# EAGLE design qec_pcb_1 (EAGLE 9.2.1)
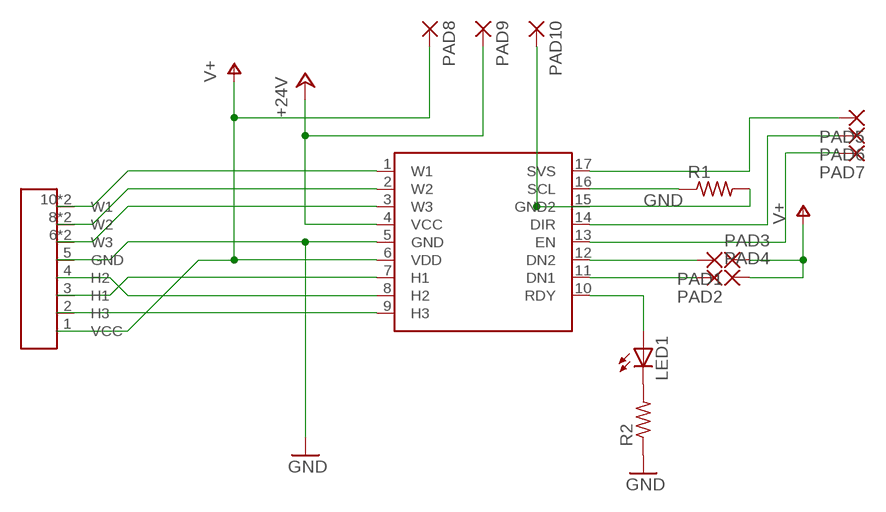
[diagram p0: schematic, sheet 1]

## Parts
K1  68611114122  [68611114122]
LED1  LEDCHIPLED_0805  [CHIPLED_0805]
PAD1  SMD2  [SMD1,27-2,54]
PAD2  SMD2  [SMD1,27-2,54]
PAD3  SMD2  [SMD1,27-2,54]
PAD4  SMD2  [SMD1,27-2,54]
PAD5  SMD2  [SMD1,27-2,54]
PAD6  SMD2  [SMD1,27-2,54]
PAD7  SMD2  [SMD1,27-2,54]
PAD8  SMD5  [SMD2,54-5,08]
PAD9  SMD5  [SMD2,54-5,08]
PAD10  SMD5  [SMD2,54-5,08]
R1  R-US_M0805  [M0805]
R2  R-US_M0805  [M0805]
U$1  1-Q-EC1-Q-EC-SMD  [1-Q-EC-SMD]

## Nets
+24V: PAD9.1(P) U$1.4(VCC)
GND: K1.5(GND) PAD10.1(P) R1.2 R2.1 U$1.5(GND) U$1.15(GND2)
N$1: LED1.C R2.2
N$2: LED1.A U$1.10(RDY)
N$3: PAD2.1(P) U$1.11(DN1)
N$4: PAD1.1(P) U$1.12(DN2)
N$5: K1.10(W1) K1.11(W1) U$1.1(W1)
N$6: R1.1 U$1.16(SCL)
N$8: PAD6.1(P) U$1.14(DIR)
N$9: PAD7.1(P) U$1.13(EN)
N$10: PAD5.1(P) U$1.17(SVS)
N$11: K1.8(W2) K1.9(W2) U$1.2(W2)
N$12: K1.6(W3) K1.7(W3) U$1.3(W3)
N$13: K1.3(H1) U$1.7(H1)
N$14: K1.4(H2) U$1.8(H2)
N$16: K1.2(H3) U$1.9(H3)
V+: K1.1(VCC) PAD3.1(P) PAD4.1(P) PAD8.1(P) U$1.6(VDD)

## Library data of the parts
K1 = dedo:68611114122: WR-FPC 1.00mm SMT ZIF Horizontal Top Contact, 11 Pins=>Code : Con_FPC_ZIF_1.00_68611114122 <http://katalog.we-online.de/media/images/eican/Con_FPC_ZIF_1.00_6861xx14122_pf2.jpg> Details see: http://katalog.we-online.de/en/em/686_1xx_141_22 Created 2014-07-09, Karrer Zheng 2014 (C) Würth Elektronik
LED1 = led:LED: LED OSRAM: - CHIPLED LG R971, LG N971, LY N971, LG Q971, LY Q971, LO R971, LY R971 LH N974, LH R974 LS Q976, LO Q976, LY Q976 LO Q996 - Hyper CHIPLED LW Q18S LB Q993, LB Q99A, LB R99A - SideLED LS A670, LO A670, LY A670, LG A670, LP A670 LB A673, LV A673, LT A673, LW A673 LH A674 LY A675 LS A676, LA A676, LO A676, LY A676, LW A676 LS A679, LY A679, LG A679 - Hyper Micro SIDELED® LS Y876, LA Y876, LO Y876, LY Y876 LT Y87S - SmartLED LW L88C, LW L88S LB L89C, LB L89S, LG L890 LS L89K, LO L89K, LY L89K LS L896, LA L896, LO L896, LY L896 - TOPLED LS T670, LO T670, LY T670, LG T670, LP T670 LSG T670, LSP T670, LSY T670, LOP T670, LYG T670 LG T671, LOG T671, LSG T671 LB T673, LV T673, LT T673, LW T673 LH T674 LS T676, LA T676, LO T676, LY T676, LB T676, LH T676, LSB T676, LW T676 LB T67C, LV T67C, LT T67C, LS T67K, LO T67K, LY T67K, LW E67C LS E67B, LA E67B, LO E67B, LY E67B, LB E67C, LV E67C, LT E67C LW T67C LS T679, LY T679, LG T679 LS T770, LO T770, LY T770, LG T770, LP T770 LB T773, LV T773, LT T773, LW T773 LH T774 LS E675, LA E675, LY E675, LS T675 LS T776, LA T776, LO T776, LY T776, LB T776 LHGB T686 LT T68C, LB T68C - Hyper Mini TOPLED® LB M676 - Mini TOPLED Santana® LG M470 LS M47K, LO M47K, LY M47K Source: http://www.osram.convergy.de LUXEON: - LUMILED® LXK2-PW12-R00, LXK2-PW12-S00, LXK2-PW14-U00, LXK2-PW14-V00 LXK2-PM12-R00, LXK2-PM12-S00, LXK2-PM14-U00 LXK2-PE12-Q00, LXK2-PE12-R00, LXK2-PE12-S00, LXK2-PE14-T00, LXK2-PE14-U00 LXK2-PB12-K00, LXK2-PB12-L00, LXK2-PB12-M00, LXK2-PB14-N00, LXK2-PB14-P00, LXK2-PB14-Q00 LXK2-PR12-L00, LXK2-PR12-M00, LXK2-PR14-Q00, LXK2-PR14-R00 LXK2-PD12-Q00, LXK2-PD12-R00, LXK2-PD12-S00 LXK2-PH12-R00, LXK2-PH12-S00 LXK2-PL12-P00, LXK2-PL12-Q00, LXK2-PL12-R00 Source: www.luxeon.com KINGBRIGHT: KA-3528ASYC Source: www.kingbright.com
PAD1-PAD7 = wirepad:SMD2: SMD PAD
PAD8-PAD10 = wirepad:SMD5: SMD PAD
R1 R2 = resistor:R-US_: RESISTOR, American symbol
U$1 = dedo:1-Q-EC

## Board
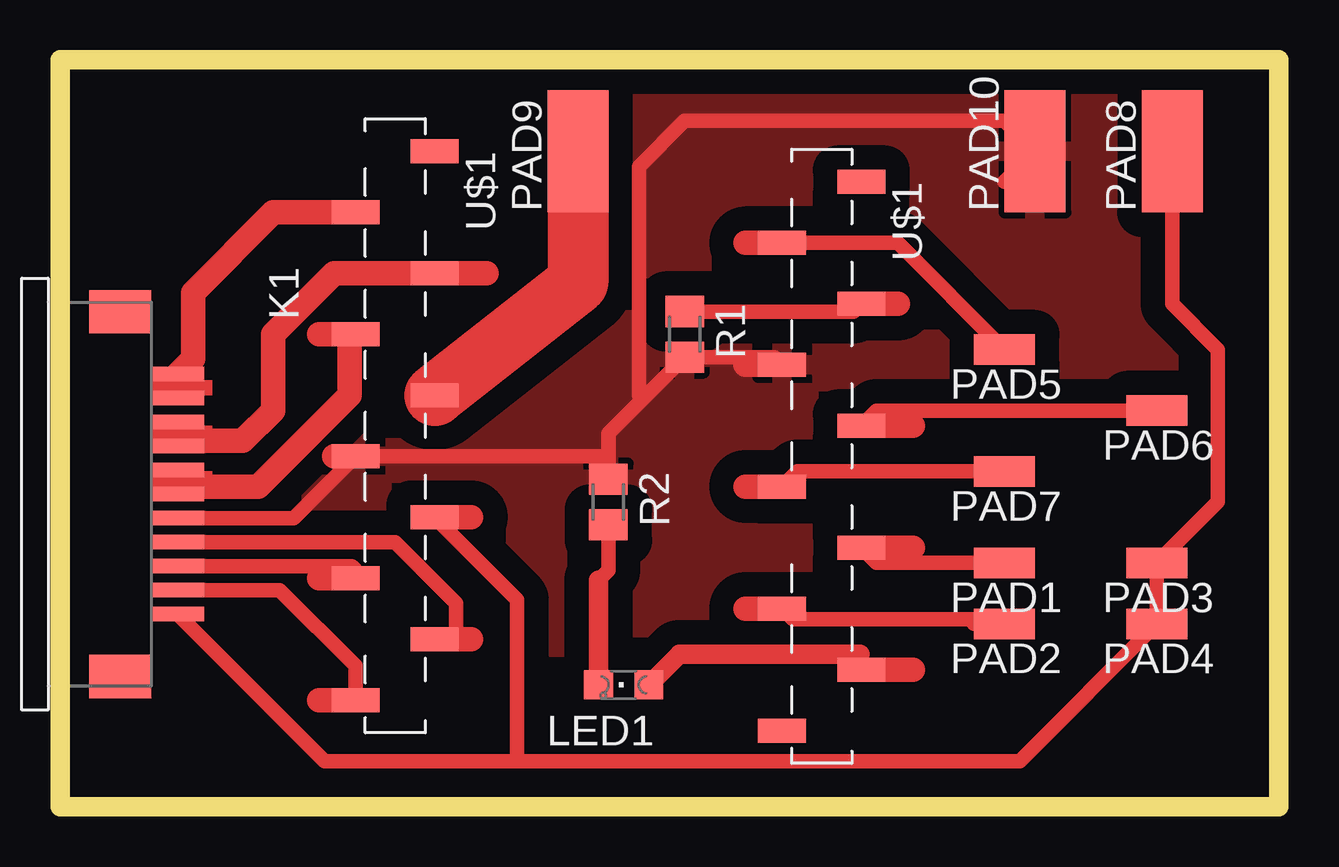
[diagram p1: board, top side]

Size 50.8 x 31.11 mm. Coordinates in mm from the lower left corner, seen from the top.
Outline: 0,31.11 50.8,31.11 50.8,0 0,0 0,31.11
Copper layers (1*16): Top 0.035mm / dielectric 1.5mm / Bottom 0.035mm
Design rules "default": minimum track width 6mil, minimum drill 0.35mm, track to track 6mil, track to pad 6mil, pad to pad 6mil, via to via 6mil, smd to smd 6mil, copper to edge 40mil, drill to drill 6mil, minimum pad ring 10mil, minimum via ring 8mil, stop-mask expansion 4mil, vias tented up to drill 0mil, thermal gap 10mil

### Footprints (pad centres in the part's own frame; a part is rotated, then mirrored left to right if it is on the bottom)
68611114122 = smd 0.6 x 2.2: 1 1.5,1.1; 2 0.5,1.1; 3 -0.5,1.1; 4 -1.5,1.1; 5 -2.5,1.1; 6 -3.5,1.1; 7 -4.5,1.1; 8 -5.5,1.1; 9 -6.5,1.1; 10 -7.5,1.1; 11 -8.5,1.1 | smd 1.8 x 2.6: Z1 -11.1,-1.3; Z2 4.1,-1.3
CHIPLED_0805 = smd 1.2 x 1.2: A 0,-1.05; C 0,1.05
SMD1,27-2,54 = smd 1.27 x 2.54: 1 0,0
SMD2,54-5,08 = smd 2.54 x 5.08: 1 0,0
M0805 = smd 1.3 x 1.6: 1 -0.95,0; 2 0.95,0
1-Q-EC-SMD = smd 2 x 1: 1 -10.54,7.62; 1A -7.24,10.16; 1A1 10.54,8.89; 2 -7.24,5.08; 3 -10.54,2.54; 4 -7.24,0; 5 -10.54,-2.54; 6 -7.24,-5.08; 7 -10.54,-7.62; 8 -7.24,-10.16; 9 -10.54,-12.7; 10 10.54,-11.43; 10B1 7.24,-13.97; 11 7.24,-8.89; 12 10.54,-6.35; 13 7.24,-3.81; 14 10.54,-1.27; 15 7.24,1.27; 16 10.54,3.81; 17 7.24,6.35

### Placement (x,y rotation side)
K1  3.81,9.53 270 top
LED1  23.5,5.08 90 top
PAD1  39.37,10.16 90 top
PAD2  39.37,7.62 90 top
PAD3  45.72,10.16 90 top
PAD4  45.72,7.62 90 top
PAD5  39.37,19.05 90 top
PAD6  45.72,16.51 90 top
PAD7  39.37,13.97 90 top
PAD8  46.35,27.3 0 top
PAD9  21.59,27.3 0 top
PAD10  40.64,27.3 0 top
R1  470  [M0805]  26.04,19.68 270 top
R2  1k  [M0805]  22.86,12.7 270 top
U$1  22.86,17.14 0 top

### Tracks (layer width: path | path; a pad name or v marks a point on that pad's centre or on a via)
+24V
  Top 2.54: U$1.4 21.59,21.84 PAD9.1
GND
  Top 0.61: 39.37,26.04 PAD10.1 39.37,28.57 26.04,28.57 24.13,26.67 24.13,17.14 24.29,16.99 | K1.5 9.74,12.03 U$1.5 22.86,14.61 | 22.86,14.61 R2.1 | 22.86,14.61 22.86,15.56 24.29,16.99 | 24.29,16.99 R1.2 29.78,18.73 U$1.15
  Top 1.016: U$1.5 11.43,14.61 | U$1.15 28.57,18.41
  pour Top (isolate 1.016): 0,31.11 50.8,31.11 50.8,0 0,0
N$1
  Top 0.61: R2.2 22.86,9.85 22.45,9.43
  Top 0.813: 22.45,9.43 LED1.C
N$2
  Top 0.61: 33.34,6.35 U$1.10
  Top 0.813: LED1.A 25.82,6.35 33.34,6.35
  Top 1.016: U$1.10 35.56,5.71
N$3
  Top 0.61: 38.1,7.62 PAD2.1 39.18,7.81 30.55,7.81 U$1.11
  Top 1.016: U$1.11 28.57,8.26
N$4
  Top 0.61: U$1.12 34.03,10.16 PAD1.1
  Top 1.016: U$1.12 35.56,10.79
N$5
  Top 0.61: 5.58,18.02 K1.11 K1.10
  Top 1.016: K1.11 5.54,18.66 5.54,21.42 8.89,24.77 U$1.1
N$6
  Top 0.61: R1.1 33.08,20.64 U$1.16
  Top 1.016: U$1.16 34.92,20.95
N$8
  Top 0.61: PAD6.1 34.03,16.51 U$1.14
  Top 1.016: U$1.14 35.56,15.88
N$9
  Top 0.61: PAD7.1 30.73,13.97 U$1.13
  Top 1.016: U$1.13 28.57,13.34
N$10
  Top 0.61: U$1.17 34.92,23.5 PAD5.1
  Top 1.016: U$1.17 28.57,23.5
N$11
  Top 0.61: K1.9 4.91,15.24 K1.8
  Top 1.016: 4.91,15.24 7.62,15.24 8.89,16.51 8.89,19.68 11.43,22.23 U$1.2 17.78,22.23
N$12
  Top 0.61: K1.6 K1.7 5.6,13.34 | 12.06,19.43 U$1.3
  Top 1.016: 12.06,19.43 12.06,17.14 8.26,13.34 5.6,13.34 | U$1.3 10.79,19.68
N$13
  Top 0.61: K1.3 12.16,10.03 arc-90 U$1.7
  Top 1.016: U$1.7 10.79,9.53
N$14
  Top 0.61: K1.4 13.96,11.03 16.51,8.48 16.51,6.99 U$1.8
  Top 1.016: U$1.8 17.14,6.99
N$16
  Top 0.61: K1.2 9.16,9.03 12.32,5.87 U$1.9
  Top 1.016: U$1.9 10.79,4.45
V+
  Top 0.61: 5.31,8.03 K1.1 11.03,1.91 19.05,1.91 | PAD8.1 46.35,20.95 48.26,19.05 48.26,12.7 PAD3.1 PAD4.1 40.01,1.91 19.05,1.91 | U$1.6 19.05,8.63 19.05,1.91
  Top 1.016: U$1.6 17.14,12.06
(copper drawn outside any net)
  shapes: Top area x3